# Altium schematic sheet H01R0_Frontend.SchDoc
size Letter; CompanyName: Hexabitz; DocumentNumber: 3; SheetNumber: 2; SheetTotal: 2; Module_Name: H0ARA; Module_Description: Humidity and Tempurature Sensor
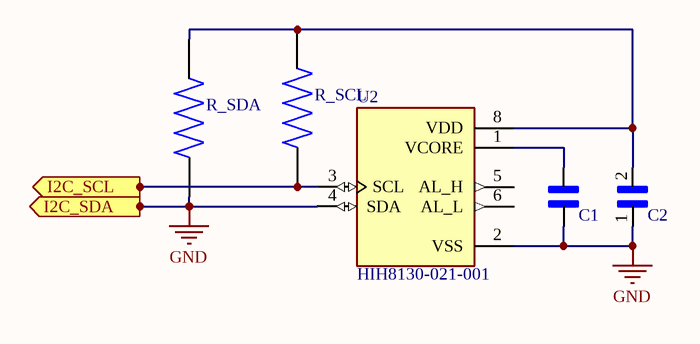
[diagram p0: H01R0_Frontend.SchDoc]

## Parts
C1  GRM033C71C104KE14D  [CAPC0603X33N]  (value not drawn)
C2  GRM188R71C224KA01D  [CAPC1608X90N]  (value not drawn)
R_SCL  CRGCQ0603J2K2  [RESC1608X55N]  (value not drawn)
R_SDA  CRGCQ0603J2K2  [RESC1608X55N]  (value not drawn)
U2  HIH8130-021-001  [SOIC127P600X206-8N]

## Ports
I2C_SCL (out), I2C_SDA (out)

## Nets
GND: C1.1 C2.1 R_SDA.1 U2.2(VSS) U2.4(SDA) ; port I2C_SDA
I2C_SCL: R_SCL.1 U2.3(SCL) ; port I2C_SCL
NetC1_2: C1.2 U2.1(VCORE)
NetC2_2: C2.2 R_SCL.2 R_SDA.2 U2.8(VDD)

Not connected (* = marked no-connect by the designer): U2 5(AL_H) 6(AL_L)

## Notes on the sheet
- Module:
- Title:
- Description:
- Size:
- Revision:
- Letter
- www.hexabitz.com
- Date:
- Time:
- Sheet
- of

## Library data of the parts
C1 = GRM033C71C104KE14D: 0.1 ÂµF Â±10% 16V Ceramic Capacitor X7S 0201 (0603 Metric); MF: Murata Electronics; SnapEDA_Link: https://www.snapeda.com/parts/GRM033C71C104KE14D/Murata+Electronics+North+America/view-part/?ref=snap; Package: 0603 Murata; Value: *; MP: GRM033C71C104KE14D; Check_prices: https://www.snapeda.com/parts/GRM033C71C104KE14D/Murata+Electronics+North+America/view-part/?ref=eda
C2 = GRM188R71C224KA01D: SMD Capacitor X7R_EIA_ with Capacitance: 0.22uF Tol. 10%. Rated Voltage: 16Vdc; MF: Murata; SnapEDA_Link: https://www.snapeda.com/parts/GRM188R71C224KA01D/Murata%20Electronics%20North%20America/view-part/1758738/?ref=snap; Value: *; MP: GRM188R71C224KA01D; Availability: Unavailable; Package: 1608 Murata; Price: None
R_SCL R_SDA = CRGCQ0603J2K2: Fixed Resistor CRGCQ 0603 2K2 5%; MF: TE Connectivity; SnapEDA_Link: https://www.snapeda.com/parts/CRGCQ0603J2K2/TE+Connectivity/view-part/?ref=snap; Package: 1608 Rohm Semiconductor; Value: *; MP: CRGCQ0603J2K2; Check_prices: https://www.snapeda.com/parts/CRGCQ0603J2K2/TE+Connectivity/view-part/?ref=eda
U2 = HIH8130-021-001: MF: {'manufacturer': u'Honeywell Sensing and Productivity Solutions'}; Package: None; Price: None; Value: *; MP: HIH8130-021-001; Availability: Unavailable